# EAGLE design CrackberryPi_1.0.6.3_power (EAGLE 7.2.0)
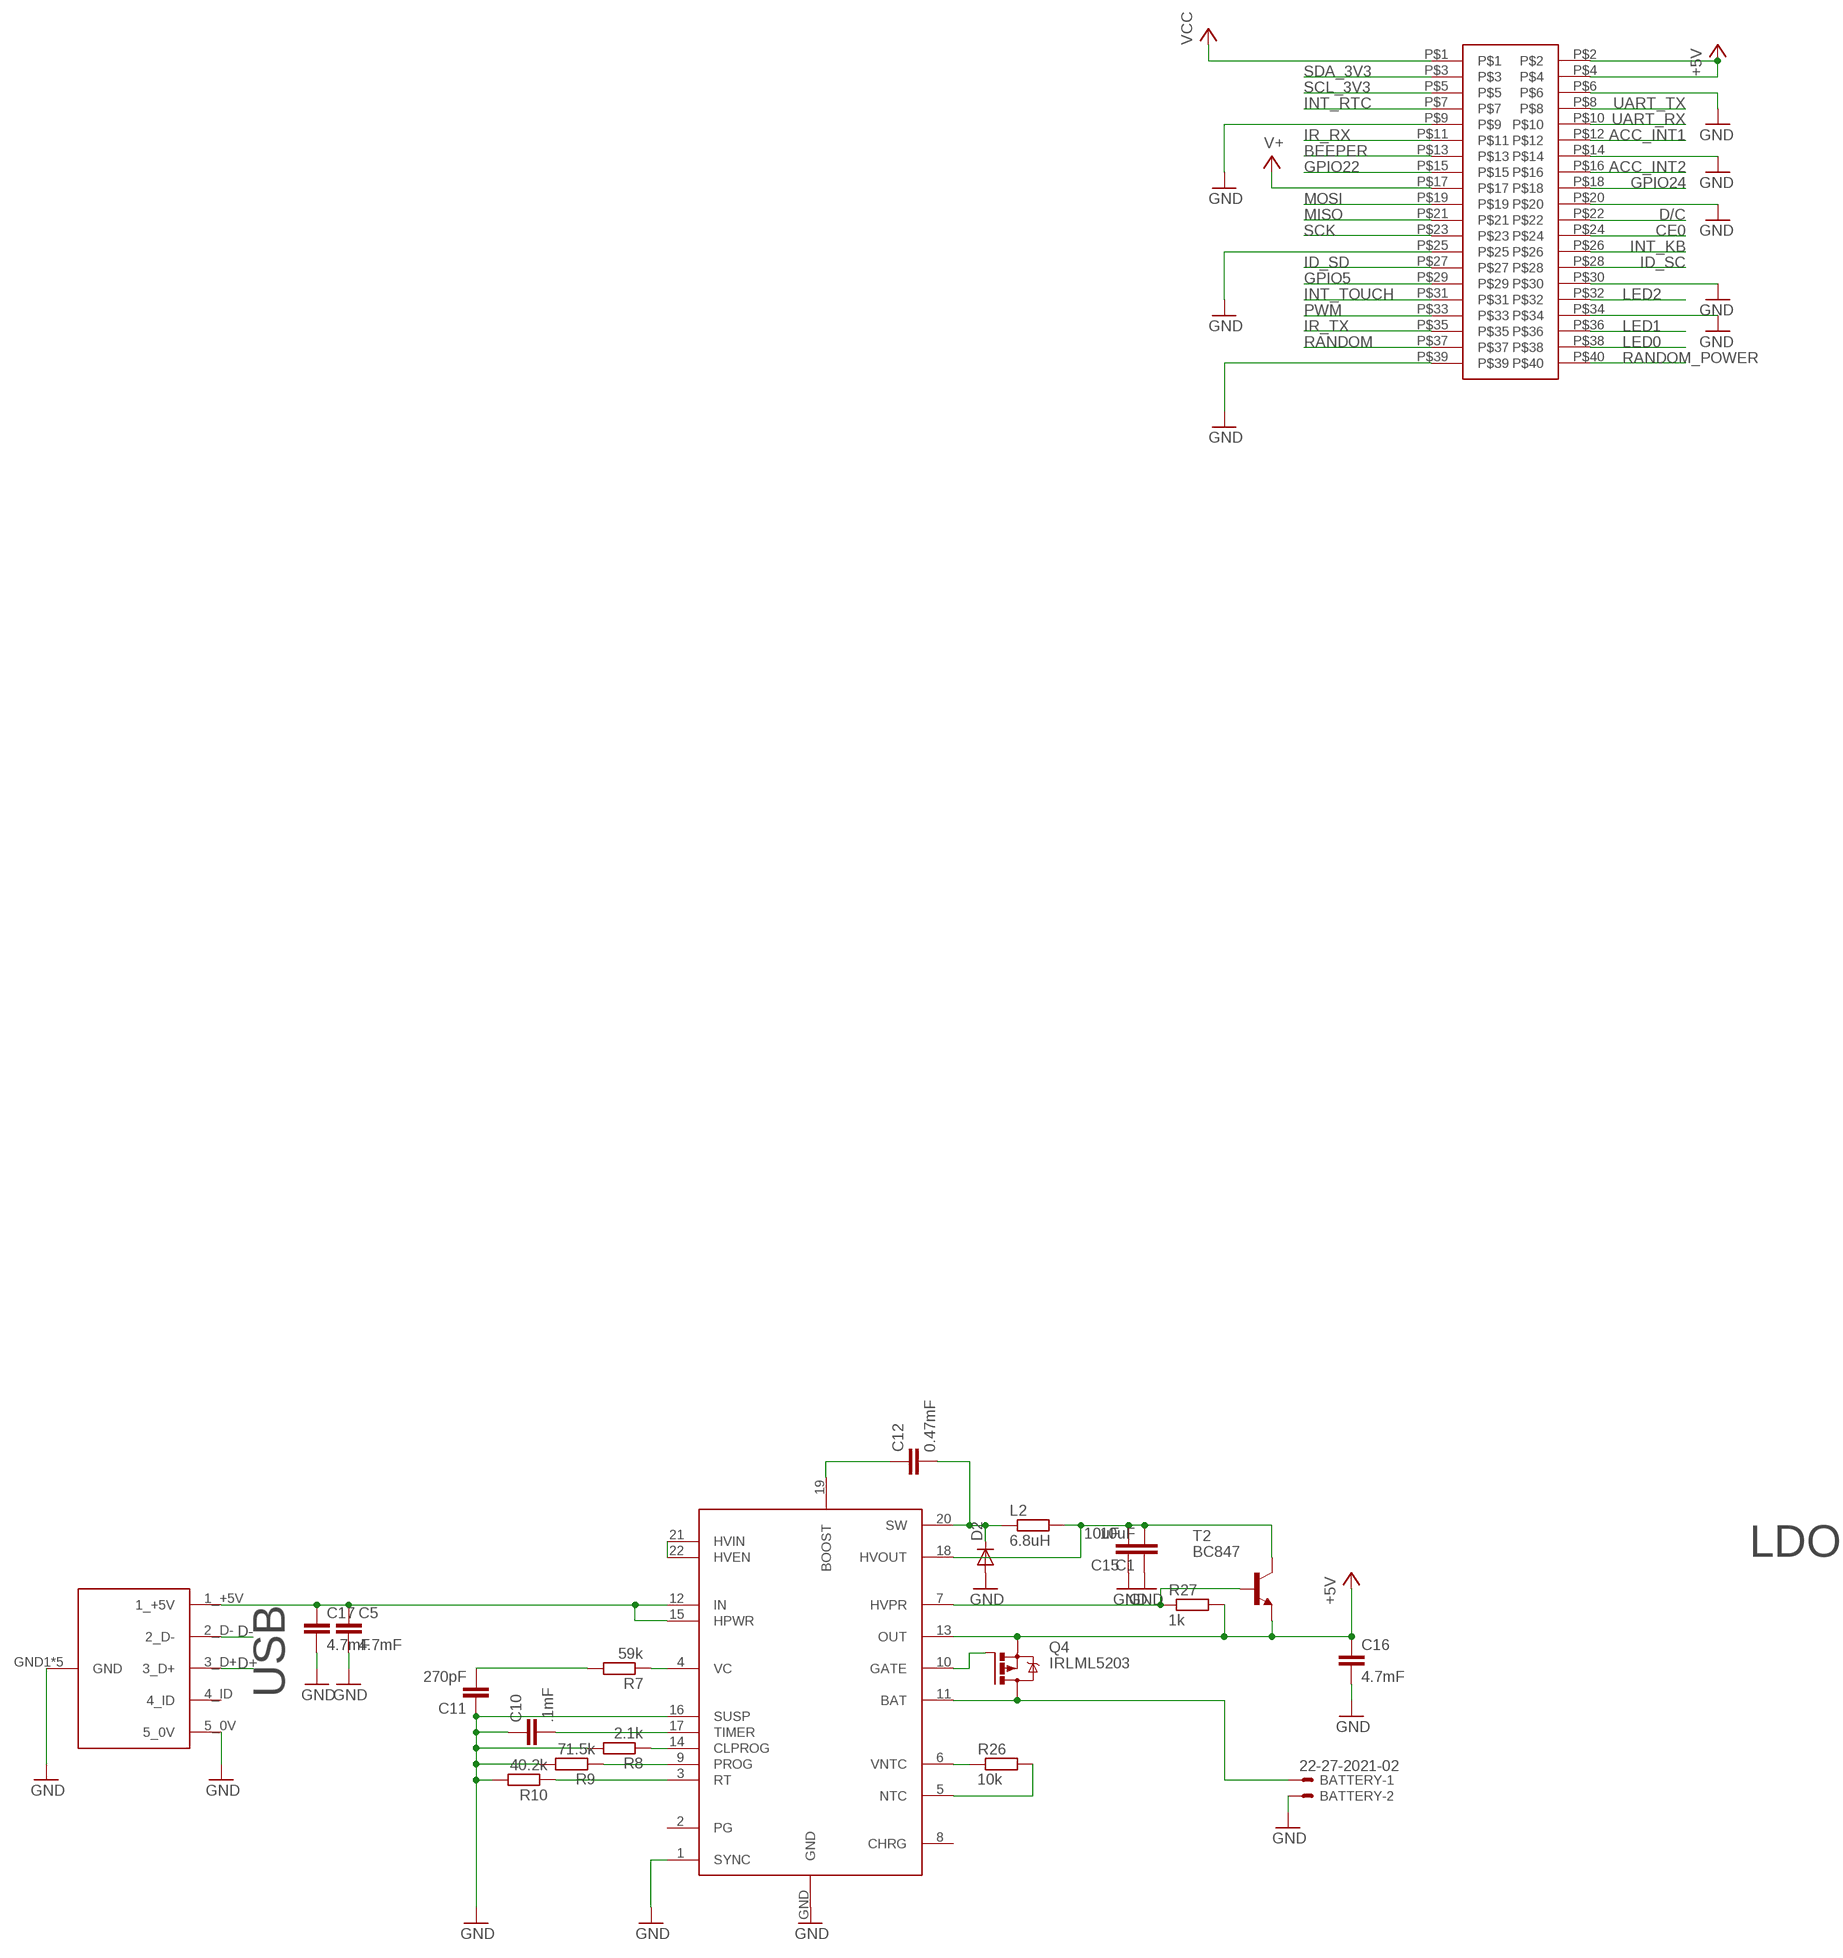
[diagram p0: schematic, sheet 1]

## Parts
BATTERY  22-27-2021-02  [6410-02]
C1  10uF  C-EUC0603  [C0603]
C5  4.7mF  C-EUC0603  [C0603]
C10  .1mF  C-EUC0603  [C0603]
C11  270pF  C-EUC0603  [C0603]
C12  0.47mF  C-EUC0603  [C0603]
C15  10uF  C-EUC0603  [C0603]
C16  4.7mF  C-EUC0603  [C0603]
C17  4.7mF  C-EUC0603  [C0603]
D2  DIODE-SOD123  [SOD123]
L2  6.8uH  R-EU_R2010  [R2010]
Q4  IRLML5203  [MICRO3]
R7  59k  R-EU_R0603  [R0603]
R8  2.1k  R-EU_R0603  [R0603]
R9  71.5k  R-EU_R0603  [R0603]
R10  40.2k  R-EU_R0603  [R0603]
R26  10k  R-EU_R0603  [R0603]
R27  1k  R-EU_R0603  [R0603]
T2  BC847  [SOT23]
U$1  LTC4090  [DFN22]
U$9  MICRO_USB  [MICRO_USB]
U$11  HEADER  [20X2]

## Nets
+5V: C16.1 Q4.2(S) R27.2 T2.2(E) U$1.13(OUT) U$11.P$2 U$11.P$4
ACC_INT1: U$11.P$12
ACC_INT2: U$11.P$16
BAT: BATTERY.1 Q4.3(D) U$1.11(BAT)
BEEPER: U$11.P$13
BOOST: C12.1 U$1.19(BOOST)
CE0: U$11.P$24
D+: U$9.3_D+
D-: U$9.2_D-
D/C: U$11.P$22
GND: BATTERY.2 C1.1 C5.2 C10.1 C11.1 C15.1 C16.2 C17.2 D2.A R8.2 R9.2 R10.2 U$1.1(SYNC) U$1.16(SUSP) U$1.GND U$9.5_0V U$9.GND1(GND) U$9.GND2(GND) U$9.GND5(GND) U$9.P$1(GND) U$9.P$7(GND) U$11.P$6 U$11.P$9 U$11.P$14 U$11.P$20 U$11.P$25 U$11.P$30 U$11.P$34 U$11.P$39
GPIO5: U$11.P$29
GPIO22: U$11.P$15
GPIO24: U$11.P$18
HVOUT: C1.2 C15.2 L2.2 T2.3(C) U$1.18(HVOUT)
HVPR: R27.1 T2.1(B) U$1.7(HVPR)
ID_SC: U$11.P$28
ID_SD: U$11.P$27
IN: C5.1 C17.1 U$1.12(IN) U$1.15(HPWR) U$9.1_+5V
INT_KB: U$11.P$26
INT_RTC: U$11.P$7
INT_TOUCH: U$11.P$31
IR_RX: U$11.P$11
IR_TX: U$11.P$35
LED0: U$11.P$38
LED1: U$11.P$36
LED2: U$11.P$32
MISO: U$11.P$21
MOSI: U$11.P$19
N$3: R9.1 U$1.9(PROG)
N$4: R10.1 U$1.3(RT)
N$5: R8.1 U$1.14(CLPROG)
N$6: R7.1 U$1.4(VC)
N$7: C10.2 U$1.17(TIMER)
N$8: C11.2 R7.2
N$9: U$1.21(HVIN) U$1.22(HVEN)
N$21: R26.1 U$1.6(VNTC)
N$27: R26.2 U$1.5(NTC)
N$33: Q4.1(G) U$1.10(GATE)
PWM: U$11.P$33
RANDOM: U$11.P$37
RANDOM_POWER: U$11.P$40
SCK: U$11.P$23
SCL_3V3: U$11.P$5
SDA_3V3: U$11.P$3
SW: C12.2 D2.C L2.1 U$1.20(SW)
UART_RX: U$11.P$10
UART_TX: U$11.P$8
V+: U$11.P$17
VCC: U$11.P$1
Unconnected: U$1.2(PG) U$1.8(CHRG) U$9.4_ID

## Notes on the sheet
- LDO
- USB

## Library data of the parts
BATTERY = con-molex:22-?-02: CONNECTOR wire to board 2.54 mm (.1 inch) pitch header; OC_FARNELL: unknown; OC_NEWARK: unknown
C1 C5 C10-C12 C15-C17 = rcl:C-EU: CAPACITOR, European symbol
D2 = diode:DIODE-: DIODE
L2 R7-R10 R26 R27 = rcl:R-EU_: RESISTOR, European symbol
Q4 = transistor-power:IRLML5203: HEXFET P-Channel Power MOSFET
T2 = transistor:BC847: NPN TRANSISTOR
U$1 = LTC4090:LTC4090
U$9 = MICRO_USB:MICRO_USB
U$11 = 20x2_cirqoid:HEADER

## Board
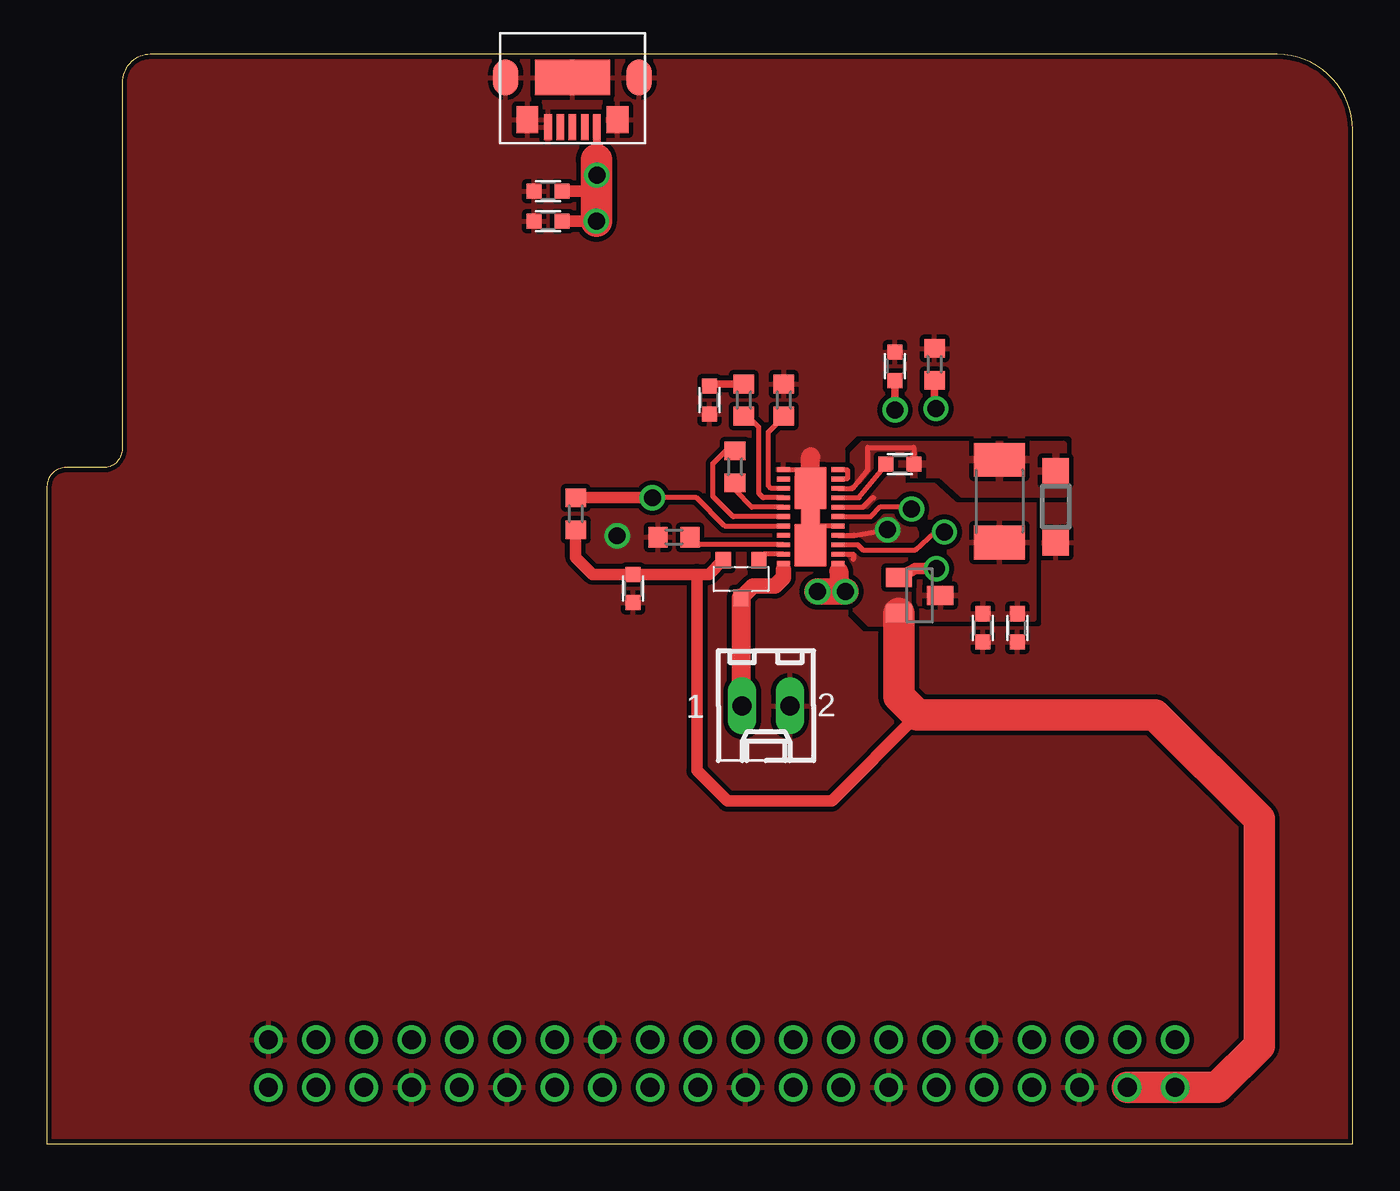
[diagram p1: board, top side]
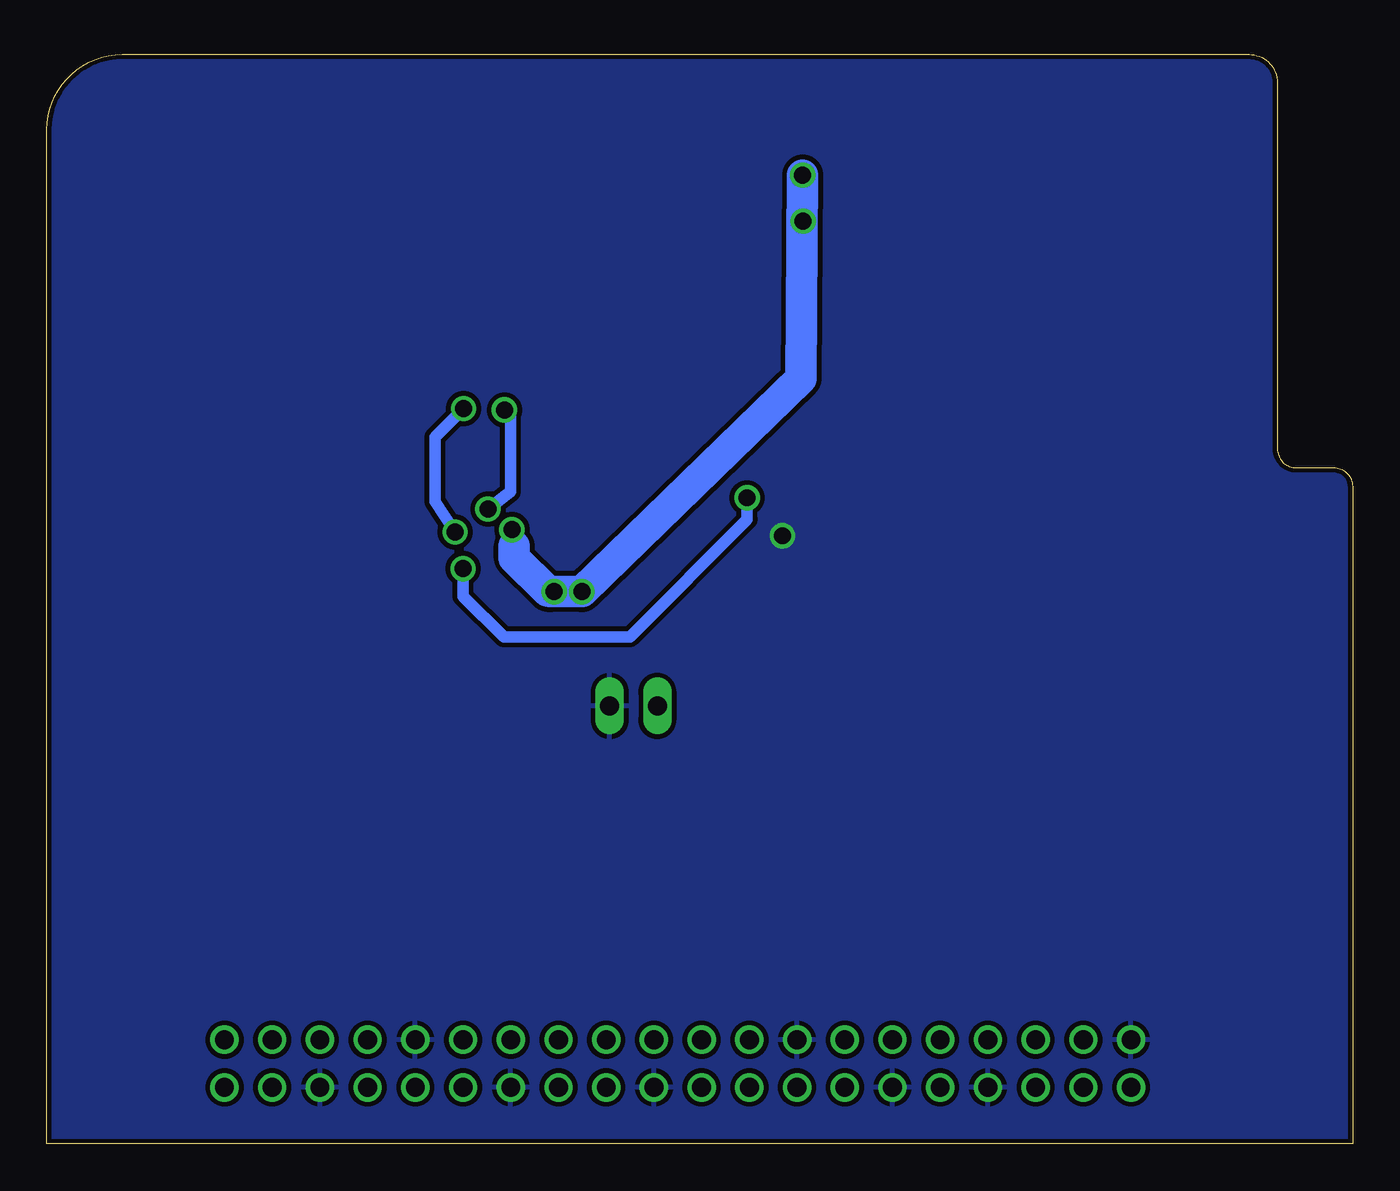
[diagram p2: board, bottom side, seen from below]

Size 69.5 x 58 mm. Coordinates in mm from the lower left corner, seen from the top.
Outline: 0,35 0,0 69.5,0 69.5,54 arc90 65.5,58 5.5,58 arc90 4,56.5 4,37 arc-90 3,36 1,36 arc90 0,35
Copper layers (1*16): Top 0.035mm / dielectric 1.5mm / Bottom 0.035mm
Design rules "SeeedStudio_2layer_DRU_no_angle_20140221": minimum track width 6mil, minimum drill 12mil, track to track 6mil, track to pad 6mil, pad to pad 6mil, via to via 6mil, smd to smd 0mil, copper to edge 10mil, drill to drill 10mil, minimum pad ring 10mil, minimum via ring 6mil, stop-mask expansion 2mil, vias tented up to drill 100mil, thermal gap 10mil

### Footprints (pad centres in the part's own frame; a part is rotated, then mirrored left to right if it is on the bottom)
6410-02 = drill 1.016 long: 1 1.27,0; 2 -1.27,0
C0603 = smd 0.8 x 0.8: 1 -0.75,0; 2 0.75,0
SOD123 = smd 1.4 x 1.4: A 1.9,0; C -1.9,0
R2010 = smd 1.8 x 2.7: 1 -2.2,0; 2 2.2,0
MICRO3 = smd 0.8 x 0.9: 1 -0.95,-1; 2 0.95,-1; 3 0,1
R0603 = smd 1 x 1.1: 1 -0.85,0; 2 0.85,0
SOT23 = smd 1 x 1.4: 1 -0.95,-1.1; 2 0.95,-1.1; 3 0,1.1
DFN22 = smd 0.25 x 0.7: 1 -2.5,-1.45; 2 -2,-1.45; 3 -1.5,-1.45; 4 -1,-1.45; 5 -0.5,-1.45; 6 0,-1.45; 7 0.5,-1.45; 8 1,-1.45; 9 1.5,-1.45; 10 2,-1.45; 11 2.5,-1.45; 12 2.5,1.45; 13 2,1.45; 14 1.5,1.45; 15 1,1.45; 16 0.5,1.45; 17 0,1.45; 18 -0.5,1.45; 19 -1,1.45; 20 -1.5,1.45; 21 -2,1.45; 22 -2.5,1.45 | smd 2.2 x 1.65: GND 1.525,0; GND1 -1.5,0 | smd 0.9 x 0.9: P$1 0,0
MICRO_USB = smd 0.4 x 1.4: 1_+5V -1.3,2.65; 2_D- -0.65,2.65; 3_D+ 0,2.65; 4_ID 0.65,2.65; 5_0V 1.3,2.65 | smd 4 x 1.9: GND1 0,0 | smd 1.35 x 1.9: GND2 -3.55,0; GND5 3.55,0 | smd 1.15 x 1.45: P$1 -2.4,2.25; P$7 2.4,2.25
20X2 = drill 1: P$1 0,0; P$2 0,2.54; P$3 2.54,0; P$4 2.54,2.54; P$5 5.08,0; P$6 5.08,2.54; P$7 7.62,0; P$8 7.62,2.54; P$9 10.16,0; P$10 10.16,2.54; P$11 12.7,0; P$12 12.7,2.54; P$13 15.24,0; P$14 15.24,2.54; P$15 17.78,0; P$16 17.78,2.54; P$17 20.32,0; P$18 20.32,2.54; P$19 22.86,0; P$20 22.86,2.54; P$21 25.4,0; P$22 25.4,2.54; P$23 27.94,0; P$24 27.94,2.54; P$25 30.48,0; P$26 30.48,2.54; P$27 33.02,0; P$28 33.02,2.54; P$29 35.56,0; P$30 35.56,2.54; P$31 38.1,0; P$32 38.1,2.54; P$33 40.64,0; P$34 40.64,2.54; P$35 43.18,0; P$36 43.18,2.54; P$37 45.72,0; P$38 45.72,2.54; P$39 48.26,0; P$40 48.26,2.54

### Placement (x,y rotation side)
BATTERY  38.27,23.32 180 top
C1  51.65,27.48 90 top
C5  26.68,50.73 180 top
C10  45.15,41.4 270 top
C11  35.27,39.6 90 top
C12  45.4,36.2 0 top
C15  49.83,27.48 90 top
C16  31.2,29.57 270 top
C17  26.68,49.12 180 top
D2  53.7,33.92 270 top
L2  50.7,34.23 270 top
Q4  36.95,30.07 180 top
R7  37.1,39.6 90 top
R8  47.25,41.5 90 top
R9  33.38,32.3 180 top
R10  39.23,39.6 90 top
R26  36.62,36.05 270 top
R27  28.15,33.55 270 top
T2  46.45,29.2 270 top
U$1  40.65,33.4 270 top
U$9  27.98,56.77 180 top
U$11  60.05,5.55 180 top

### Tracks (layer width: path | path; a pad name or v marks a point on that pad's centre or on a via)
+5V
  Top 0.254: U$1.13 42.92,31.4 42.92,31.12
  Top 0.61: R27.2 28.15,31.23 29.05,30.32 C16.1 34.6,30.32 | Q4.2 35.25,30.32 34.6,30.32 | 34.6,30.32 34.6,19.88 36.23,18.25 41.77,18.25 46.35,22.85
  Top 1.676: U$11.P$2 U$11.P$4 62.31,3.01 64.53,5.22 64.53,17.3 58.98,22.85 46.35,22.85 45.35,23.82 T2.2
  pour Top (isolate 0.254, no thermals): 41.83,31.65 44.48,31.65 45.88,31.62 45.88,28 45.52,27.65 43.77,27.65 43.1,28.35 42.62,28.85 42.62,29.77
BAT
  Top 0.254: 39.2,30.57 U$1.11
  Top 0.813: 39.2,30.57 39.2,30.15 38.75,29.7 37.58,29.7 Q4.3
  Top 1.016: Q4.3 36.95,23.38 BATTERY.1
BOOST
  Top 0.254: U$1.19 43.23,34.4 44.52,35.98 C12.1
GND  (via drill 0.9)
  Top 0.254: U$1.16 40.92,32.9 | 40.92,32.9 40.65,32.9 U$1.GND | U$1.1 40.92,35.9 40.92,32.9
  Top 1.016: 40.65,35.55 40.65,36.58
  other vias: 30.35,32.38
  pour Bottom (isolate 0.254, rank 6): 0,35 0,0 69.5,0 69.5,54 arc90 65.5,58 5.5,58 arc90 4,56.5 4,37.02 arc-90 2.98,36 1,36 arc90
  pour Top (isolate 0.254, rank 6): 0,35 0,0 69.5,0 69.5,54 arc90 65.5,58 5.5,58 arc90 4,56.5 4,37 arc-90 3,36 1,36 arc90
HVOUT
  Top 0.254: U$1.18 43.45,33.9 43.95,34.4 44,34.4
  pour Top (isolate 0.254, rank 2): 41.75,34.12 42.67,34.15 44.23,35.7 48.2,35.58 48.73,34.58 51.5,34.65 52.52,34.62 52.52,27.95 44.77,27.95 44.75,31.1 44.8,33.08 41.7,33.33 41.7,33.85
HVPR  (via drill 0.9)
  Top 0.254: U$1.7 36.08,32.9 34.58,34.4 v32.23,34.4
  Top 0.61: R27.1 v32.23,34.4 | T2.1 46.23,30.62 v47.35,30.62
  Bottom 0.61: v47.35,30.62 47.35,29.15 45.17,27 38.48,27 32.23,33.25 v32.23,34.4
IN  (via drill 0.9)
  Top 0.2: 42.15,30.5 42.17,30.82 U$1.12
  Top 0.254: U$1.15 42.98,32.4 v44.75,32.7
  Top 0.406: U$9.1_+5V 29.27,53.15
  Top 0.61: 29.27,53.15 29.25,52.4 | C5.1 28.93,50.73 29.28,51.08 v29.28,51.57 v29.27,51.58 | C17.1 v29.25,49.12
  Top 1.016: 42.15,30.5 42.15,29.4 v42.5,29.4
  Top 1.27: v29.27,51.58 v29.25,49.12
  Top 1.422: v42.5,29.4 v41.02,29.4
  Top 1.676: 29.25,52.4 v29.25,49.12
  Bottom 0.61: 44.62,31.82 v44.75,32.7
  Bottom 1.676: v29.27,51.58 29.35,40.75 v41.02,29.4 42.73,29.4 42.85,29.43 44.62,31.2 44.62,31.82
  pour Top (isolate 0.254): 46.4,32.25 45.9,31.75 45.25,31.75 44.08,31.7 41.92,31.88 41.92,33.4 44,33.4 44.5,33.9 45.67,33.9
N$3
  Top 0.254: U$1.9 34.75,31.9 R9.1
N$4
  Top 0.254: U$1.3 38.55,34.9 38.4,35.05 38.4,37.9 39.12,38.62 R10.1
N$5  (via drill 0.9)
  Top 0.254: U$1.14 43.15,31.9 43.42,31.62 46.23,31.62 47.27,32.58 v47.77,32.58
  Top 0.406: v47.33,39.15 47.25,39.33 R8.1
  Bottom 0.61: v47.77,32.58 48.85,34.2 48.85,37.62 v47.33,39.15
N$6
  Top 0.254: U$1.4 38.12,34.4 37.9,34.62 37.9,38.17 37.25,38.85 R7.1
N$7  (via drill 0.9)
  Top 0.254: U$1.17 43.85,33.4 44.38,33.92 45.9,33.92 v46.02,33.8
  Top 0.406: v45.15,39.08 C10.2
  Bottom 0.61: v46.02,33.8 44.83,34.73 44.83,38.75 v45.15,39.08
N$8
  Top 0.406: R7.2 35.38,40.45 C11.2
N$9
  Top 0.254: U$1.22 42.6,35.9 42.6,35.4 U$1.21
N$21
  Top 0.254: U$1.6 36.52,33.4 35.45,34.48 35.45,36.23 36.15,36.92 R26.1
N$27
  Top 0.254: U$1.5 37.52,33.9 36.65,34.8 R26.2
N$33
  Top 0.254: U$1.10 38.15,31.4 Q4.1
SCL_3V3
  Bottom 0.254: 54.95,5.57 U$11.P$5
SW
  Top 0.254: U$1.20 42.9,34.9 43.7,35.88 43.7,37.08 46.15,37.08 C12.2
  pour Top (isolate 0.254): 41.85,34.42 42.77,34.45 43.95,35.62 47.6,35.62 48.73,34.6 54.1,34.58 54.1,37.23 51.95,37.23 43.48,37.25 42.92,36.73 42.92,35.8